# EAGLE design Base Board (EAGLE 9.5.1)
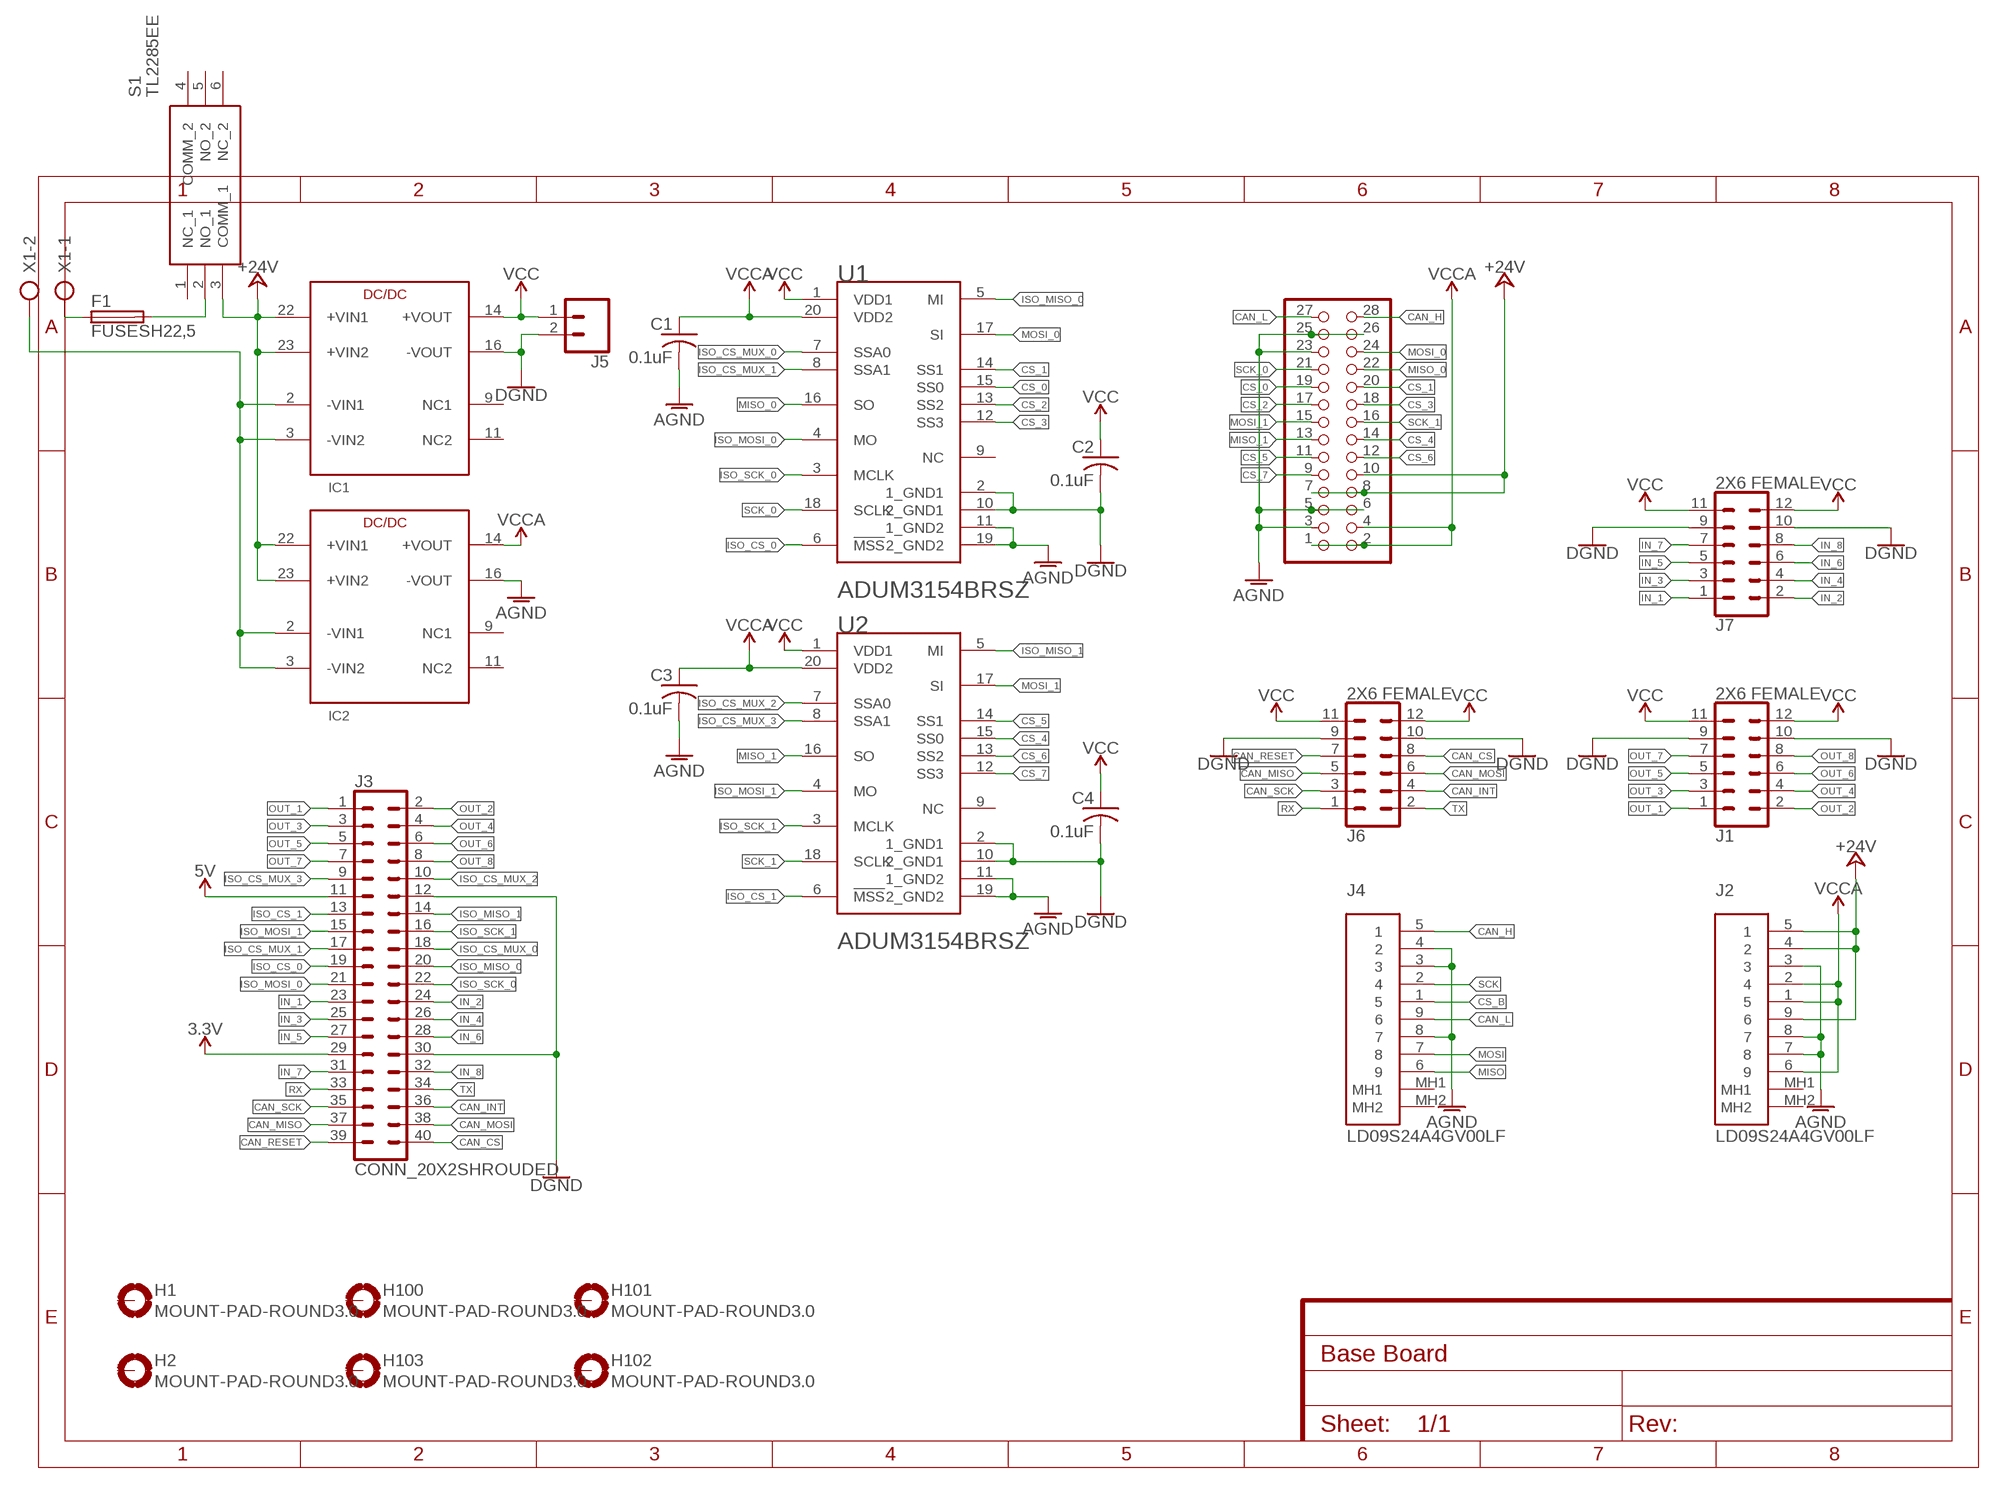
[diagram p0: schematic, sheet 1]

## Parts
C1  0.1uF  C-USC0805  [C0805]
C2  0.1uF  C-USC0805  [C0805]
C3  0.1uF  C-USC0805  [C0805]
C4  0.1uF  C-USC0805  [C0805]
F1  FUSESH22,5  [SH22,5]
H1  MOUNT-PAD-ROUND3.0  [3,0-PAD]
H2  MOUNT-PAD-ROUND3.0  [3,0-PAD]
H100  MOUNT-PAD-ROUND3.0  [3,0-PAD]
H101  MOUNT-PAD-ROUND3.0  [3,0-PAD]
H102  MOUNT-PAD-ROUND3.0  [3,0-PAD]
H103  MOUNT-PAD-ROUND3.0  [3,0-PAD]
IC1  TEL_5_SERIES  [TEL_5_SERIES]
IC2  TEL_5_SERIES  [TEL_5_SERIES]
J1  2X6 FEMALE  CONN_06X2PTH_FEMALE  [2X6]
J2  LD09S24A4GV00LF  [LD09S24A4GV00LF]
J3  CONN_20X2SHROUDED  [2X20_SHROUDED]
J4  LD09S24A4GV00LF  [LD09S24A4GV00LF]
J5  CONN_02POLAR_LOCK  [MOLEX-1X2_LOCK]
J6  2X6 FEMALE  CONN_06X2PTH_FEMALE  [2X6]
J7  2X6 FEMALE  CONN_06X2PTH_FEMALE  [2X6]
JP1  PINHD-2X14/90  [2X14/90]
S1  TL2285EE  [TL2285EE]
U1  ANALOG_DEVICES_INC_ADUM3154BRSZANALOG_DEVICES_INC_ADUM3154BRSZ_0_0  [ANALOG_DEVICES_INC_ADUM3154BRSZ_0]
U2  ANALOG_DEVICES_INC_ADUM3154BRSZANALOG_DEVICES_INC_ADUM3154BRSZ_0_0  [ANALOG_DEVICES_INC_ADUM3154BRSZ_0]
X1  AK500/2-H  [AK500/2-H]

## Nets
3.3V: J3.29
5V: J3.11
+24V: IC1.22(+VIN1) IC1.23(+VIN2) IC2.22(+VIN1) IC2.23(+VIN2) J2.4 J2.5 J2.9 JP1.7 JP1.8 JP1.10 S1.3(COMM_1)
AGND: C1.2 C3.2 IC2.16(-VOUT) J2.3 J2.7 J2.8 J4.3 J4.4 J4.8 JP1.3 JP1.5 JP1.6 JP1.23 JP1.25 JP1.26 U1.11(1_GND2) U1.19(2_GND2) U2.11(1_GND2) U2.19(2_GND2)
CAN_CS: J3.40 J6.8
CAN_H: J4.5 JP1.28
CAN_INT: J3.36 J6.4
CAN_L: J4.9 JP1.27
CAN_MISO: J3.37 J6.5
CAN_MOSI: J3.38 J6.6
CAN_RESET: J3.39 J6.7
CAN_SCK: J3.35 J6.3
CS_0: JP1.19 U1.15(SS0)
CS_1: JP1.20 U1.14(SS1)
CS_2: JP1.17 U1.13(SS2)
CS_3: JP1.18 U1.12(SS3)
CS_4: JP1.14 U2.15(SS0)
CS_5: JP1.11 U2.14(SS1)
CS_6: JP1.12 U2.13(SS2)
CS_7: JP1.9 U2.12(SS3)
CS_B: J4.1
GND: C2.2 C4.2 IC1.16(-VOUT) J1.9 J1.10 J3.12 J3.30 J5.2 J6.9 J6.10 J7.9 J7.10 U1.2(1_GND1) U1.10(2_GND1) U2.2(1_GND1) U2.10(2_GND1) ; supply symbol labelled DGND
IN_1: J3.23 J7.1
IN_2: J3.24 J7.2
IN_3: J3.25 J7.3
IN_4: J3.26 J7.4
IN_5: J3.27 J7.5
IN_6: J3.28 J7.6
IN_7: J3.31 J7.7
IN_8: J3.32 J7.8
ISO_CS_0: J3.19 U1.6(!MSS!)
ISO_CS_1: J3.13 U2.6(!MSS!)
ISO_CS_MUX_0: J3.18 U1.7(SSA0)
ISO_CS_MUX_1: J3.17 U1.8(SSA1)
ISO_CS_MUX_2: J3.10 U2.7(SSA0)
ISO_CS_MUX_3: J3.9 U2.8(SSA1)
ISO_MISO_0: J3.20 U1.5(MI)
ISO_MISO_1: J3.14 U2.5(MI)
ISO_MOSI_0: J3.21 U1.4(MO)
ISO_MOSI_1: J3.15 U2.4(MO)
ISO_SCK_0: J3.22 U1.3(MCLK)
ISO_SCK_1: J3.16 U2.3(MCLK)
MISO: J4.6
MISO_0: JP1.22 U1.16(SO)
MISO_1: JP1.13 U2.16(SO)
MOSI: J4.7
MOSI_0: JP1.24 U1.17(SI)
MOSI_1: JP1.15 U2.17(SI)
N$1: IC1.2(-VIN1) IC1.3(-VIN2) IC2.2(-VIN1) IC2.3(-VIN2) X1.2
N$2: F1.1 X1.1
N$3: F1.2 S1.2(NO_1)
OUT_1: J1.1 J3.1
OUT_2: J1.2 J3.2
OUT_3: J1.3 J3.3
OUT_4: J1.4 J3.4
OUT_5: J1.5 J3.5
OUT_6: J1.6 J3.6
OUT_7: J1.7 J3.7
OUT_8: J1.8 J3.8
RX: J3.33 J6.1
SCK: J4.2
SCK_0: JP1.21 U1.18(SCLK)
SCK_1: JP1.16 U2.18(SCLK)
TX: J3.34 J6.2
VCC: C2.1 C4.1 IC1.14(+VOUT) J1.11 J1.12 J5.1 J6.11 J6.12 J7.11 J7.12 U1.1(VDD1) U2.1(VDD1)
VCCA: C1.1 C3.1 IC2.14(+VOUT) J2.1 J2.2 J2.6 JP1.1 JP1.2 JP1.4 U1.20(VDD2) U2.20(VDD2)
Unconnected: H1.B3,0(MOUNT) H2.B3,0(MOUNT) H100.B3,0(MOUNT) H101.B3,0(MOUNT) H102.B3,0(MOUNT) H103.B3,0(MOUNT) IC1.9(NC1) IC1.11(NC2) IC2.9(NC1) IC2.11(NC2) J2.MH1 J2.MH2 J4.MH1 J4.MH2 S1.1(NC_1) S1.4(COMM_2) S1.5(NO_2) S1.6(NC_2) U1.9(NC) U2.9(NC)

## Library data of the parts
C1-C4 = adafruit:C-US: CAPACITOR, American symbol
F1 = fuse:FUSE: Fuse; OC_FARNELL: unknown; OC_NEWARK: unknown
H1 H2 H100-H103 = holes:MOUNT-PAD-ROUND: MOUNTING PAD, round
IC1 IC2 = traco_thl_tel_series:TEL_5_SERIES: TRACO POWER DC/DC converter TEL 5 Series created by Mario Blunk - electronics & IT engineering at www.train-z.de
J1 J6 J7 = SparkFun-Connectors:CONN_06X2: Multi connection point. Often used as Generic Header-pin footprint for 0.1 inch spaced/style header connections On any of the 0.1 inch spaced packages, you can populate with these: Break Away Headers - Straight <https://www.sparkfun.com/products/116> (PRT-00116) Break Away Male Headers - Right Angle <https://www.sparkfun.com/products/553> (PRT-00553) Female Headers <https://www.sparkfun.com/products/115> (PRT-00115) Break Away Headers - Machine Pin <https://www.sparkfun.com/products/117> (PRT-00117) Break Away Female Headers - Swiss Machine Pin <https://www.sparkfun.com/products/743> (PRT-00743); PROD_ID: CONN-12423
J2 J4 = D-Sub Connectors:LD09S24A4GV00LF: CONN D-SUB RCPT 9POS VERT SOLDER Manufacturer's datasheet <https://www.amphenol-icc.com/media/wysiwyg/files/drawing/10130912.pdf>; CREATED_BY: PCBLayout.com; DIGIKEY_PART_NUMBER: 609-5190-ND; MANUFACTURER: Amphenol ICC (FCI); MPN: LD09S24A4GV00LF
J3 = SparkFun-Connectors:CONN_20X2: Multi connection point. Often used as Generic Header-pin footprint for 0.1 inch spaced/style header connections On any of the 0.1 inch spaced packages, you can populate with these: Break Away Headers - Straight <https://www.sparkfun.com/products/116> (PRT-00116) Break Away Male Headers - Right Angle <https://www.sparkfun.com/products/553> (PRT-00553) Female Headers <https://www.sparkfun.com/products/115> (PRT-00115) Break Away Headers - Machine Pin <https://www.sparkfun.com/products/117> (PRT-00117) Break Away Female Headers - Swiss Machine Pin <https://www.sparkfun.com/products/743> (PRT-00743); PROD_ID: CONN-12263; SF_ID: CONN-12263
J5 = SparkFun-Connectors:CONN_02: Multi connection point. Often used as Generic Header-pin footprint for 0.1 inch spaced/style header connections On any of the 0.1 inch spaced packages, you can populate with these: Break Away Headers - Straight <https://www.sparkfun.com/products/116> (PRT-00116) Break Away Male Headers - Right Angle <https://www.sparkfun.com/products/553> (PRT-00553) Female Headers <https://www.sparkfun.com/products/115> (PRT-00115) Break Away Headers - Machine Pin <https://www.sparkfun.com/products/117> (PRT-00117) Break Away Female Headers - Swiss Machine Pin <https://www.sparkfun.com/products/743> (PRT-00743) For SCREWTERMINALS and SPRING TERMINALS visit here: Screw Terimnals on SparkFun.com <https://www.sparkfun.com/search/results?term=Screw+Terminals> (5mm/3.5mm/2.54mm spacing) This device is also useful as a general connection point to wire up your design to another part of your project. Our various solder wires solder well into these plated through hole pads. Hook-Up Wire - Assortment (Stranded, 22 AWG) <https://www.sparkfun.com/products/11375> (PRT-11375) Hook-Up Wire - Assortment (Solid Core, 22 AWG) <https://www.sparkfun.com/products/11367> (PRT-11367) View the entire wire category on our website here <https://www.sparkfun.com/categories/141> Special notes: Molex polarized connector foot print use with: PRT-08233 with associated crimp pins and housings. 2.54_SCREWTERM for use with PRT-10571. 3.5mm Screw Terminal footprints for PRT-08084 5mm Screw Terminal footprints for use with PRT-08432; SF_ID: PRT-09918
JP1 = pinhead:PINHD-2X14: PIN HEADER
S1 = TL2285EE:TL2285EE: Tactile Switches DPDT ALT ACT PC MNT Source: Datasheet <https://componentsearchengine.com/Datasheets/1/TL2285EE.pdf>; DESCRIPTION: Tactile Switches DPDT ALT ACT PC MNT; HEIGHT: 13mm; MANUFACTURER_NAME: E-Switch; MANUFACTURER_PART_NUMBER: TL2285EE; MOUSER_PART_NUMBER: 612-TL2285EE
U1 U2 = Analog Devices Inc - ADUM3154BRSZ:ANALOG_DEVICES_INC_ADUM3154BRSZ: Digital Isolators 20-Pin SSOP Tube; AMBIENT_TEMPERATURE_RANGE_HIGH: +125°C; AMBIENT_TEMPERATURE_RANGE_LOW: -40°C; CENTROID_NOT_SPECIFIED: No; DATASHEET: http://www.analog.com/media/en/technical-documentation/data-sheets/ADuM3154.pdf; DEVICE_CLASS_L1: Integrated Circuits (ICs); DEVICE_CLASS_L2: Interface ICs; DEVICE_CLASS_L3: unset; DIGIKEY_DESCRIPTION: IC DGTL ISO 3.75KV 4CH SPI 20SSOP; DIGIKEY_PART_NUMBER: ADUM3154BRSZ-ND; FOOTPRINT_PARAMETERS_0: {"fp_type":"SSOP","params":{"N":{"nom":20,"long name":"Number of leads","min":null,"max":null,"short name":"N","type":"count"},"A":{"nom":false,"long name":"Height","min":false,"max":2000000,"short name":"A","type":"measurement"},"A1":{"nom":false,"long name":"Package clearance","min":50000,"max":false,"short name":"A1","type":"measurement"},"A2":{"nom":1750000,"long name":"Package height","min":1650000,"max":1850000,"short name":"A2","type":"measurement"},"E":{"nom":7800000,"long name":"Width /w leads","min":7400000,"max":8199999,"short name":"E","type":"measurement"},"E1":{"nom":5300000,"long name":"Package width","min":5000000,"max":5600000,"short name":"E1","type":"measurement"},"D":{"nom":7200000,"long name":"Package length","min":6900000,"max":7500000,"short name":"D","type":"measurement"},"B":{"nom":false,"long name":"Lead width","min":220000,"max":380000,"short name":"B","type":"measurement"},"C":{"nom":false,"long name":"Lead thickness","min":90000,"max":250000,"short name":"C","type":"measurement"},"L":{"nom":750000,"long name":"Lead foot length","min":550000,"max":950000,"short name":"L","type":"measurement"},"e":{"nom":650000,"long name":"Lead pitch","min":null,"max":null,"short name":"e","type":"measurement"},"PHI":{"nom":false,"long name":"Lead angle","min":0,"max":8,"short name":"PHI","type":"measurement"},"HT":{"default":"No","long name":"Thermal pad","type":"multichoiceparent","short name":"HT","children":[]},"offset x":{"nom":0,"long name":"X Center offset","min":null,"max":null,"short name":"offset x","type":"measurement"},"offset y":{"nom":0,"long name":"Y Center offset","min":null,"max":null,"short name":"offset y","type":"measurement"},"LS":{"default":"Rounded rectangle","long name":"Land shape","type":"multichoice","short name":"LS"},"LS1":{"default":"Rectangle","long name":"Land shape (Pin 1)","type":"multichoice","short name":"LS1"},"solder toe":{"nom":150000,"long name":"Solder fillet (toe)","min":null,"max":null,"short name":"solder toe","type":"fixedmeasurement"},"solder heel":{"nom":250000,"long name":"Solder fillet (heel)","min":null,"max":null,"short name":"solder heel","type":"fixedmeasurement"},"solder side":{"nom":10000,"long name":"Solder fillet (side)","min":null,"max":null,"short name":"solder side","type":"fixedmeasurement"},"courtyard":{"nom":100000,"long name":"Courtyard","min":null,"max":null,"short name":"courtyard","type":"fixedmeasurement"},"SF":{"default":"C","long name":"Packing level","type":"multichoiceparent","short name":"SF","help":"http://support.upverter.com/customer/portal/articles/978783-what-is-a-footprint-packing-level","children":["solder toe","solder heel","solder side","courtyard"]}}}; HEIGHT: 2mm; INTERFACE: SPI; IPC_LAND_PATTERN_NAME: SOP65P780X200-20; LEAD_FREE: yes; MAX_SUPPLY_VOLTAGE: 5.5V; MF: Analog Devices Inc; MFG_PACKAGE_IDENT: RS-20; MFG_PACKAGE_IDENT_DATE: 0; MFG_PACKAGE_IDENT_REV: A; MIN_SUPPLY_VOLTAGE: 3V; MOUSER_DESCRIPTION: Digital Isolators Multip Slave Isolatr for SPI Intrface; MOUSER_PART_NUMBER: 584-ADUM3154BRSZ; MPN: ADUM3154BRSZ; PACKAGE: SSOP20; PIN_0_0_13_INSIDE_EDGE: clock; PIN_0_0_9_INSIDE_EDGE: clock; PREFIX: U; ROHS: yes; STANDOFF_HEIGHT: 0.05mm; TEMPERATURE_RANGE_HIGH: +125°C; TEMPERATURE_RANGE_LOW: -40°C; VERIFICATION_VERSION: 0.0.0.1
X1 = con-ptr500:AK500/2-H: CONNECTOR Aug. 2004 / PTR Meßtechnik: Die Bezeichnung der Serie AK505 wurde geändert. Es handelt sich hierbei um AK500 in horizontaler Ausführung.; OC_FARNELL: unknown; OC_NEWARK: unknown

## Net classes
0 default: width 0.305 mm
1 Power: width 2.032 mm

## Board
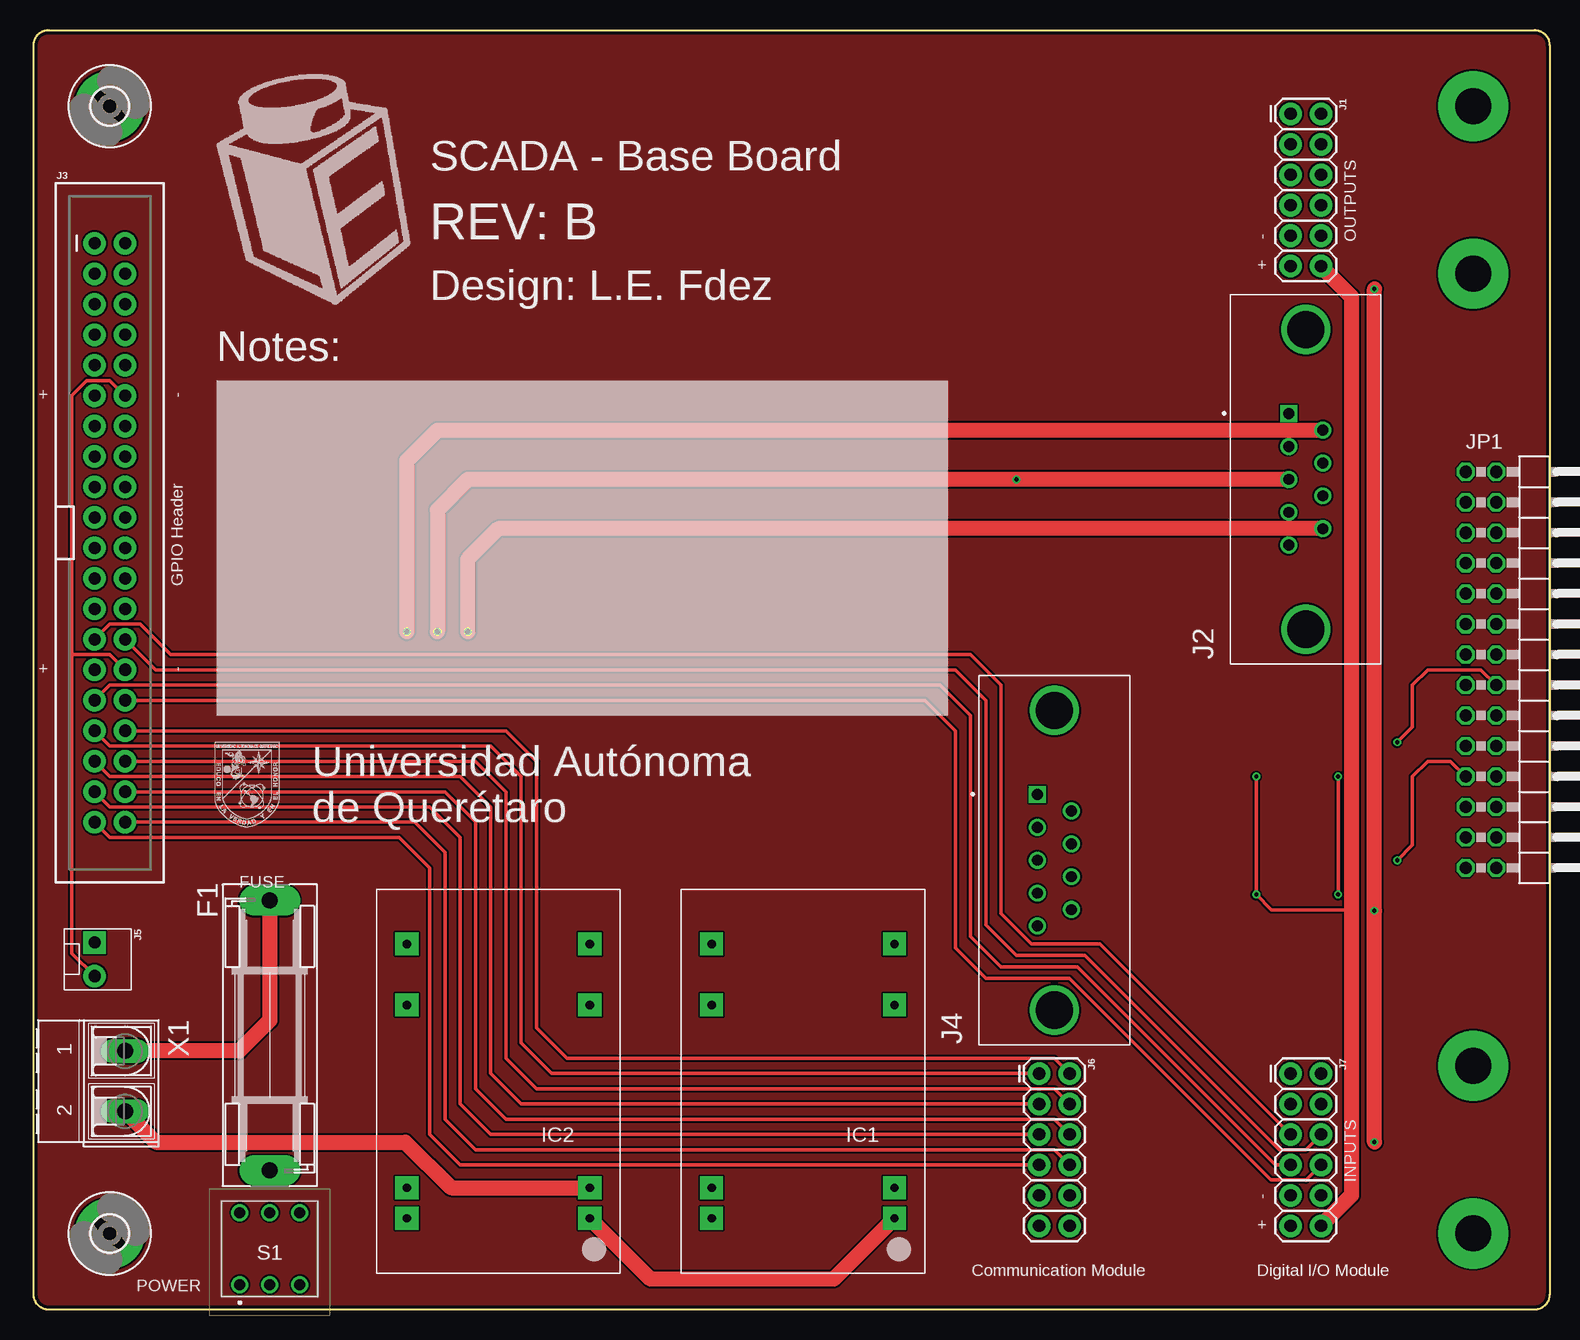
[diagram p1: board, top side]
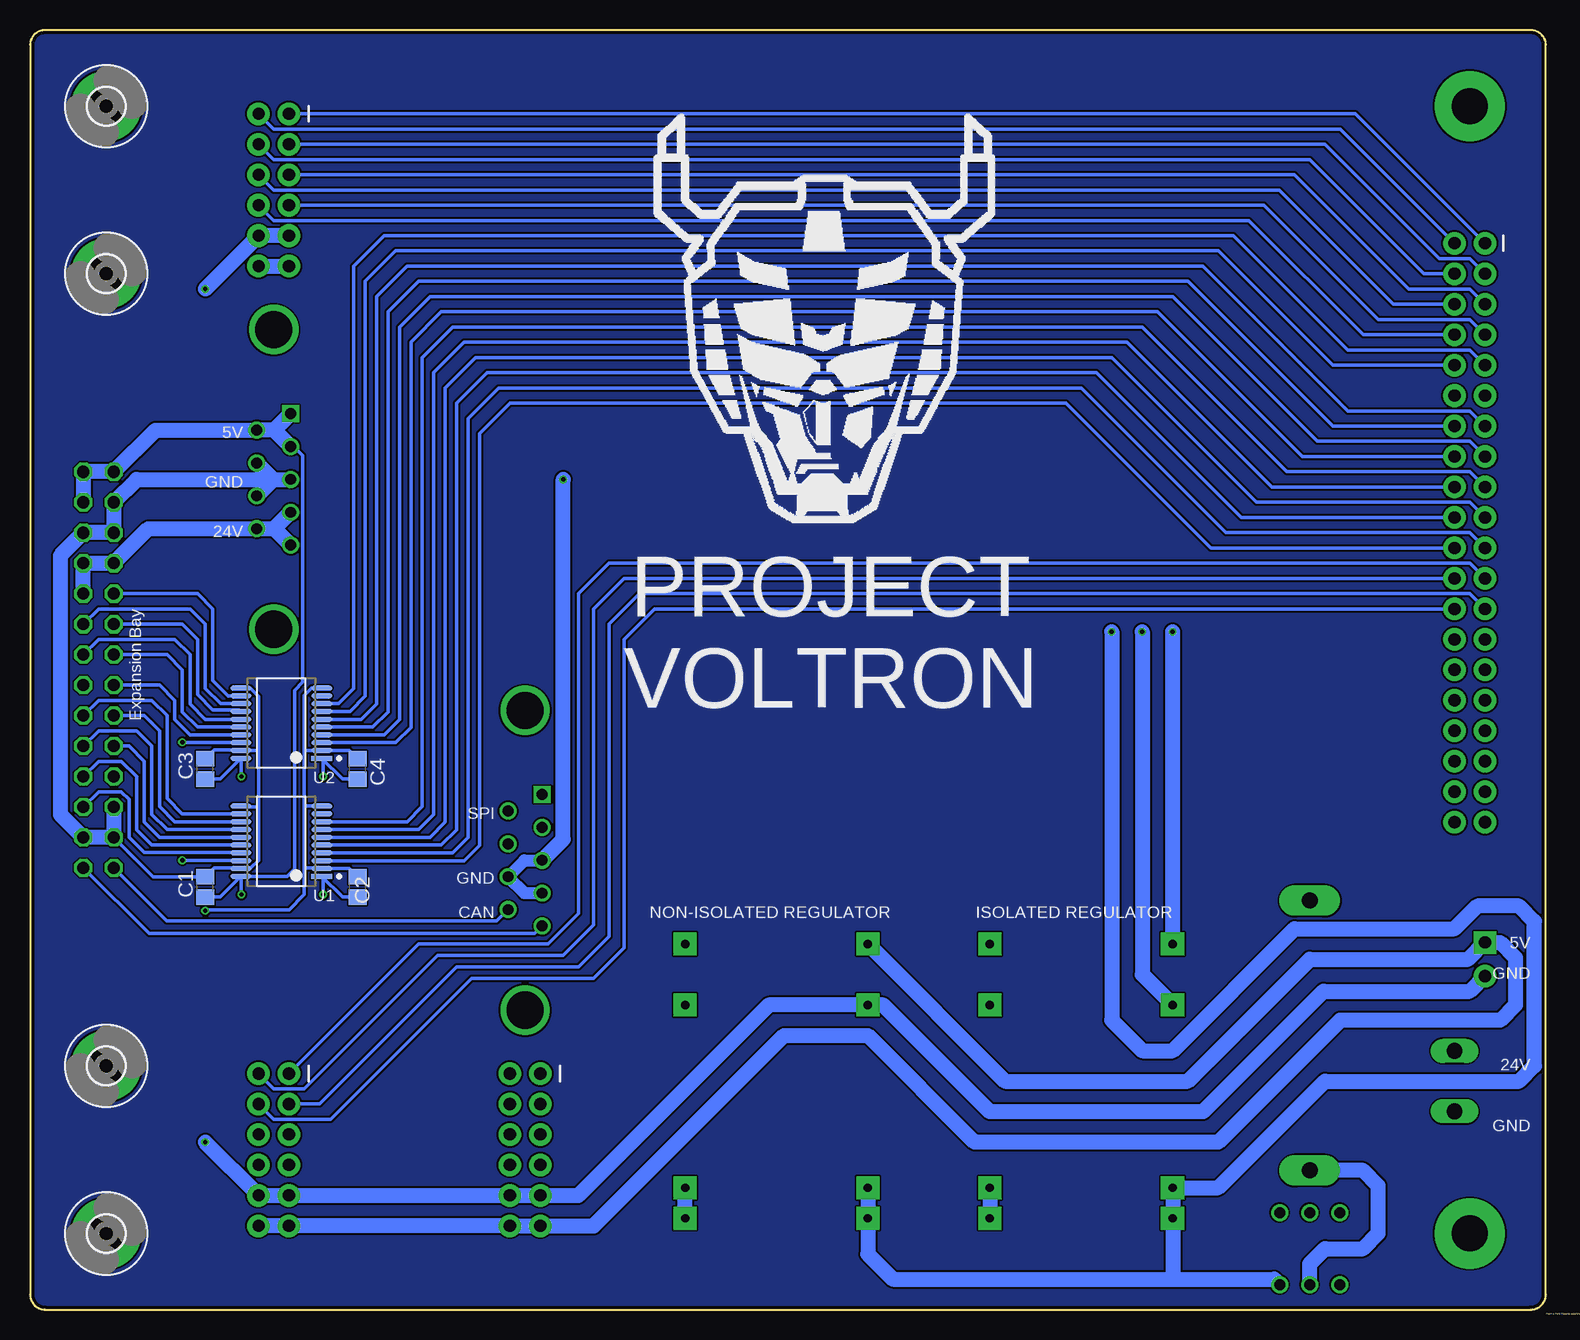
[diagram p2: board, bottom side, seen from below]

Size 126.36 x 106.68 mm. Coordinates in mm from the lower left corner, seen from the top.
Outline: 0,1.27 0,105.41 arc-90 1.27,106.68 125.09,106.68 arc-90 126.36,105.41 126.36,1.27 arc-90 125.09,0 1.27,0 arc-90 0,1.27
Copper layers (1*16): Top 0.035mm / dielectric 1.5mm / Bottom 0.035mm
Design rules "SeeedStudio_2layer_DRU_no_angle_20140221": minimum track width 6mil, minimum drill 12mil, track to track 6mil, track to pad 6mil, pad to pad 6mil, via to via 6mil, smd to smd 0mil, copper to edge 10mil, drill to drill 10mil, minimum pad ring 10mil, minimum via ring 6mil, stop-mask expansion 2mil, vias tented up to drill 100mil, thermal gap 10mil

### Footprints (pad centres in the part's own frame; a part is rotated, then mirrored left to right if it is on the bottom)
C0805 = smd 1.3 x 1.5: 1 -0.85,0; 2 0.85,0
SH22,5 = drill 1.321 pad 2.54 long: 1 -11.252,0; 2 11.252,0
3,0-PAD = drill 3 pad 5.842: B3,0 0,0
TEL_5_SERIES = drill 0.7 pad 1.93 square: 2 -11.43,-7.62; 3 -8.89,-7.62; 9 6.35,-7.62; 11 11.43,-7.62; 14 11.43,7.62; 16 6.35,7.62; 22 -8.89,7.62; 23 -11.43,7.62
2X6 = drill 1.016 pad 1.88: 1 0,0; 2 0,2.54; 3 2.54,0; 4 2.54,2.54; 5 5.08,0; 6 5.08,2.54; 7 7.62,0; 8 7.62,2.54; 9 10.16,0; 10 10.16,2.54; 11 12.7,0; 12 12.7,2.54
LD09S24A4GV00LF = drill 0.9 square: 1 5.48,1.42 | drill 0.9: 2 2.74,1.42; 3 0,1.42; 4 -2.74,1.42; 5 -5.48,1.42; 6 4.11,-1.42; 7 1.37,-1.42; 8 -1.37,-1.42; 9 -4.11,-1.42 | drill 3.1: MH1 -12.495,0; MH2 12.495,0
2X20_SHROUDED = drill 1.016 pad 1.88: 1 -1.27,24.13; 2 1.27,24.13; 3 -1.27,21.59; 4 1.27,21.59; 5 -1.27,19.05; 6 1.27,19.05; 7 -1.27,16.51; 8 1.27,16.51; 9 -1.27,13.97; 10 1.27,13.97; 11 -1.27,11.43; 12 1.27,11.43; 13 -1.27,8.89; 14 1.27,8.89; 15 -1.27,6.35; 16 1.27,6.35; 17 -1.27,3.81; 18 1.27,3.81; 19 -1.27,1.27; 20 1.27,1.27; 21 -1.27,-1.27; 22 1.27,-1.27; 23 -1.27,-3.81; 24 1.27,-3.81; 25 -1.27,-6.35; 26 1.27,-6.35; 27 -1.27,-8.89; 28 1.27,-8.89; 29 -1.27,-11.43; 30 1.27,-11.43; 31 -1.27,-13.97; 32 1.27,-13.97; 33 -1.27,-16.51; 34 1.27,-16.51; 35 -1.27,-19.05; 36 1.27,-19.05; 37 -1.27,-21.59; 38 1.27,-21.59; 39 -1.27,-24.13; 40 1.27,-24.13
MOLEX-1X2_LOCK = drill 1.016 pad 1.88 square: 1 -0.127,0 | drill 1.016 pad 1.88: 2 2.667,0
2X14/90 = drill 1.016 octagon: 1 -16.51,-6.35; 2 -16.51,-3.81; 3 -13.97,-6.35; 4 -13.97,-3.81; 5 -11.43,-6.35; 6 -11.43,-3.81; 7 -8.89,-6.35; 8 -8.89,-3.81; 9 -6.35,-6.35; 10 -6.35,-3.81; 11 -3.81,-6.35; 12 -3.81,-3.81; 13 -1.27,-6.35; 14 -1.27,-3.81; 15 1.27,-6.35; 16 1.27,-3.81; 17 3.81,-6.35; 18 3.81,-3.81; 19 6.35,-6.35; 20 6.35,-3.81; 21 8.89,-6.35; 22 8.89,-3.81; 23 11.43,-6.35; 24 11.43,-3.81; 25 13.97,-6.35; 26 13.97,-3.81; 27 16.51,-6.35; 28 16.51,-3.81
TL2285EE = drill 0.9 pad 1.4: 1 -2.5,-3; 2 0,-3; 3 2.5,-3; 4 -2.5,3; 5 0,3; 6 2.5,3
ANALOG_DEVICES_INC_ADUM3154BRSZ_0 = smd 1.753 x 0.415: 1 -3.375,2.925; 2 -3.375,2.275; 3 -3.375,1.625; 4 -3.375,0.975; 5 -3.375,0.325; 6 -3.375,-0.325; 7 -3.375,-0.975; 8 -3.375,-1.625; 9 -3.375,-2.275; 10 -3.375,-2.925; 11 3.375,-2.925; 12 3.375,-2.275; 13 3.375,-1.625; 14 3.375,-0.975; 15 3.375,-0.325; 16 3.375,0.325; 17 3.375,0.975; 18 3.375,1.625; 19 3.375,2.275; 20 3.375,2.925
AK500/2-H = drill 1.321 long: 1 -2.515,0; 2 2.515,0

### Placement (x,y rotation side)
C1  111.76,35.24 90 bottom
C2  99.06,35.24 90 bottom
C3  111.76,45.09 90 bottom
C4  99.06,45.09 90 bottom
F1  19.68,22.86 270 top
H1  6.35,100.33 0 top
H2  6.35,6.35 0 top
H100  120.02,6.35 0 bottom
H101  120.02,20.32 0 bottom
H102  120.02,86.36 0 bottom
H103  120.02,100.33 0 bottom
IC1  64.14,19.05 90 top
IC2  38.73,19.05 90 top
J1  104.78,99.69 270 top
J2  106.05,69.22 90 top
J3  6.35,64.77 0 top
J4  85.09,37.47 90 top
J5  5.08,30.48 270 top
J6  83.82,19.68 270 top
J7  104.78,19.68 270 top
JP1  125.73,53.34 270 top
S1  19.68,5.08 0 top
U1  105.41,39.05 180 bottom
U2  105.41,48.9 180 bottom
X1  7.62,19.05 270 top

### Tracks (layer width: path | path; a pad name or v marks a point on that pad's centre or on a via)
+24V  (via drill 0.35)
  Top 1.27: J2.9 38.73,65.11 36.2,62.56 v36.2,56.52
  Bottom 1.27: 106,65.11 J2.4 | 106,65.11 J2.9 116.5,65.11 JP1.7 JP1.8 JP1.10 | 106,65.11 J2.5 | S1.3 22.64,2.54 31.11,2.54 | 31.11,2.54 54.44,2.54 56.52,4.62 IC1.23 IC1.22 | 31.11,2.54 IC2.23 IC2.22 27.3,10.16 18.41,19.05 2.23,19.05 0.96,20.32 0.96,32.38 2.23,33.66 5.71,33.66 7.62,31.75 20.95,31.75 31.11,21.59 33.66,21.59 36.2,24.13 v36.2,56.52
AGND  (via drill 0.35)
  Top 1.27: J2.3 v81.92,69.22 36.2,69.22 33.66,66.67 v33.66,56.52
  Bottom 0.305: 108.84,36.83 U1.19 | 108.84,36.83 111.02,36.83 C1.2 116.1,36.09 JP1.25 | C3.2 111.02,46.67 108.73,46.67 U2.19 107.37,46.62 107.31,46.67 | U2.11 108.02,51.82 107.31,51.12 107.31,46.67 | 107.31,41.91 107.31,37.47 107.95,36.83 108.84,36.83 | 107.31,46.67 107.31,41.91 | U1.11 108.72,41.91 107.31,41.91
  Bottom 1.016: J4.3 85.14,37.47 J4.8 85.14,34.73 J4.4
  Bottom 1.27: J2.7 106.09,69.22 | J2.8 106.09,69.22 | 106.09,69.22 J2.3 | 106.09,69.22 117.47,69.22 JP1.3 JP1.5 JP1.6 123.83,62.87 123.83,41.27 JP1.26 JP1.25 JP1.23 | v33.66,56.52 33.66,27.94 IC2.16 | J4.3 81.92,39.22 v81.92,69.22
CAN_CS
  Top 0.305: J6.8 85.09,13.34 36.83,13.34 34.29,15.88 34.29,38.1 31.75,40.64 J3.40
CAN_H
  Bottom 0.305: JP1.28 116.44,31.35 84.31,31.35 J4.5
CAN_INT
  Top 0.305: J6.4 85.09,18.41 41.91,18.41 39.37,20.95 39.37,24.55 39.37,24.77 39.37,43.18 36.83,45.72 J3.36
CAN_L
  Bottom 0.305: J4.9 87.46,32.4 114.95,32.4 JP1.27
CAN_MISO
  Top 0.305: J3.37 6.35,41.91 33.02,41.91 35.56,39.37 35.56,17.14 38.1,14.61 J6.5
CAN_MOSI
  Top 0.305: J6.6 85.09,15.88 39.37,15.88 36.83,18.41 36.83,40.64 34.29,43.18 J3.38
CAN_RESET
  Top 0.305: J6.7 35.56,12.06 33.02,14.61 33.02,36.83 30.48,39.37 6.35,39.37 J3.39
CAN_SCK
  Top 0.305: J3.35 6.35,44.45 35.56,44.45 38.1,41.91 38.1,19.68 40.64,17.14 J6.3
COPPER
  pour Bottom: 0,105.41 0,1.27 arc90 1.27,0 125.09,0 arc90 126.36,1.27 126.36,105.41 arc90 125.09,106.68 1.27,106.68 arc90
  pour Top: 1.27,0 125.09,0 arc90 126.36,1.27 126.36,105.41 arc90 125.09,106.68 1.27,106.68 arc90 0,105.41 0,1.27 arc90
CS_0
  Bottom 0.305: U1.15 108.79,39.37 115.57,39.37 116.84,40.64 116.84,45.72 118.11,46.99 JP1.19
CS_1
  Bottom 0.305: JP1.20 120.65,48.26 117.47,48.26 116.2,46.99 116.2,41.3 114.94,40.03 U1.14
CS_2
  Bottom 0.305: JP1.17 116.84,49.53 115.57,48.26 115.57,41.95 114.3,40.68 U1.13
CS_3
  Bottom 0.305: JP1.18 120.65,50.8 116.2,50.8 114.94,49.53 114.94,42.6 113.67,41.33 U1.12
CS_4
  Bottom 0.305: JP1.14 120.65,55.88 114.3,55.88 113.03,54.61 113.03,50.49 111.76,49.22 U2.15
CS_5
  Bottom 0.305: U2.14 108.92,50.01 111.12,50.01 112.39,51.28 112.39,55.88 113.67,57.15 JP1.11
CS_6
  Bottom 0.305: JP1.12 120.65,58.42 113.03,58.42 111.76,57.15 111.76,51.79 110.49,50.52 U2.13
CS_7
  Bottom 0.305: U2.12 109.86,51.17 111.12,52.44 111.12,58.42 112.39,59.69 JP1.9
GND  (via drill 0.35)
  Top 0.305: J3.30 6.35,54.61 3.17,54.61 | 3.17,54.61 3.17,76.2 4.45,77.47 6.35,77.47 J3.12 | 3.17,54.61 3.17,29.72 J5.2
  Top 1.27: v111.76,13.97 v111.76,33.26 v111.76,85.09
  Bottom 0.305: C4.2 99.75,46.62 U2.2 103.45,46.62 103.5,46.67 | C2.2 99.75,36.78 U1.2 102.09,36.83 103.5,36.83 | 103.5,41.91 103.5,36.83 | 103.5,36.83 103.5,34.61 104.78,33.34 111.69,33.34 v111.76,33.26 | 103.5,41.91 103.5,46.67 | U2.10 102.87,51.82 103.5,51.19 103.5,46.67 | U1.10 103.44,41.98 103.5,41.91
  Bottom 1.27: J1.9 J1.10 v111.76,85.09 | J5.2 6.35,26.54 18.54,26.54 28.57,16.51 46.35,16.51 55.24,25.4 IC1.16 64.77,25.4 80.64,9.53 J6.9 J6.10 J7.9 J7.10 v111.76,13.97
IN_1
  Bottom 0.305: J3.23 6.35,62.23 78.11,62.23 80.64,59.69 80.64,33.02 83.19,30.48 93.98,30.48 J7.1
IN_2
  Bottom 0.305: J7.2 106.05,18.41 103.5,18.41 92.39,29.53 81.92,29.53 79.38,32.07 79.38,58.42 76.83,60.96 J3.24
IN_3
  Bottom 0.305: J3.25 6.35,59.69 75.56,59.69 78.11,57.15 78.11,31.11 80.64,28.57 90.81,28.57 102.23,17.14 J7.3
IN_4
  Bottom 0.305: J7.4 106.05,15.88 101.28,15.88 89.53,27.62 79.38,27.62 76.83,30.16 76.83,55.88 74.3,58.42 J3.26
IN_5
  Top 0.305: J3.27 6.35,57.15 8.89,57.15 11.43,54.61 78.11,54.61 80.64,52.07 80.64,33.02 83.19,30.48 88.9,30.48 J7.5
IN_6
  Top 0.305: J7.6 106.05,13.34 103.82,13.34 87.63,29.53 81.92,29.53 79.38,32.07 79.38,50.8 76.83,53.34 10.16,53.34 J3.28
IN_7
  Top 0.305: J3.31 6.35,52.07 75.56,52.07 78.11,49.53 78.11,31.11 80.64,28.57 87,28.57 103.5,12.06 J7.7
IN_8
  Top 0.305: J7.8 106.05,10.79 106.02,10.82 103.15,10.82 86.35,27.62 79.38,27.62 76.83,30.16 76.83,48.26 74.3,50.8 J3.32
ISO_CS_0
  Bottom 0.305: J3.19 6.35,67.31 24.13,67.31 36.2,79.38 89.22,79.38 91.76,76.83 91.76,40.65 93.03,39.38 U1.6
ISO_CS_1
  Bottom 0.305: U2.6 98.74,49.22 97.47,50.49 97.47,84.45 94.93,87 28.57,87 16.51,74.93 6.35,74.93 J3.13
ISO_CS_MUX_0
  Bottom 0.305: U1.7 93.98,40.03 92.71,41.3 92.71,78.11 90.17,80.64 34.92,80.64 22.86,68.58 J3.18
ISO_CS_MUX_1
  Bottom 0.305: J3.17 6.35,69.85 21.59,69.85 33.66,81.92 91.12,81.92 93.66,79.38 93.66,41.95 94.93,40.68 U1.8
ISO_CS_MUX_2
  Bottom 0.305: J3.10 17.78,78.74 27.3,88.27 95.89,88.27 98.42,85.72 98.42,51.14 99.69,49.87 U2.7
ISO_CS_MUX_3
  Bottom 0.305: J3.9 6.35,80.01 16.51,80.01 26.04,89.53 96.84,89.53 99.38,87 99.38,51.79 100.65,50.52 U2.8
ISO_MISO_0
  Bottom 0.305: U1.5 92.08,38.73 90.81,40 90.81,75.56 88.27,78.11 37.47,78.11 25.4,66.04 J3.20
ISO_MISO_1
  Bottom 0.305: J3.14 17.78,73.66 29.84,85.72 93.98,85.72 96.52,83.19 96.52,49.84 97.79,48.57 U2.5
ISO_MOSI_0
  Bottom 0.305: U1.4 91.12,38.08 89.85,39.35 89.85,74.3 87.31,76.83 38.73,76.83 26.67,64.77 6.35,64.77 J3.21
ISO_MOSI_1
  Bottom 0.305: U2.4 96.84,47.92 95.57,49.19 95.57,81.92 93.03,84.45 31.11,84.45 19.05,72.39 6.35,72.39 J3.15
ISO_SCK_0
  Bottom 0.305: J3.22 27.94,63.5 40.01,75.56 86.36,75.56 88.9,73.03 88.9,38.7 90.17,37.43 U1.3
ISO_SCK_1
  Bottom 0.305: J3.16 20.32,71.12 32.38,83.19 92.08,83.19 94.61,80.64 94.61,48.54 95.89,47.27 U2.3
MISO_0
  Bottom 0.305: U1.16 116.2,38.73 117.47,40 117.47,44.45 118.75,45.72 120.65,45.72 JP1.22
MISO_1
  Bottom 0.305: U2.16 112.39,48.57 113.67,49.84 113.67,53.34 114.94,54.61 JP1.13
MOSI_0
  Bottom 0.305: JP1.24 120.65,43.18 118.75,43.18 118.11,42.55 118.11,39.37 116.84,38.1 108.81,38.1 U1.17
MOSI_1
  Bottom 0.305: U2.17 113.03,47.92 114.3,49.19 114.3,50.8 115.57,52.07 JP1.15
N$1
  Top 1.27: IC2.3 34.79,10.16 30.98,13.97 10.19,13.97 X1.2 | IC1.2 66.67,2.54 51.44,2.54 IC2.2
  Bottom 1.27: IC2.3 IC2.2 | IC1.2 IC1.3
N$2
  Top 1.27: F1.1 19.68,24.11 17.14,21.57 X1.1
N$3
  Bottom 1.27: S1.2 19.68,3.81 18.41,5.08 15.24,5.08 13.97,6.35 13.97,10.34 15.24,11.61 F1.2
OUT_1
  Bottom 0.305: J3.1 15.88,99.69 J1.1
OUT_2
  Bottom 0.305: J3.2 17.14,98.42 106.05,98.42 J1.2
OUT_3
  Bottom 0.305: J3.3 6.35,87.63 8.89,87.63 18.41,97.16 J1.3
OUT_4
  Bottom 0.305: J1.4 106.05,95.89 19.68,95.89 10.16,86.36 J3.4
OUT_5
  Bottom 0.305: J3.5 6.35,85.09 11.43,85.09 20.95,94.61 J1.5
OUT_6
  Bottom 0.305: J1.6 106.05,93.34 22.23,93.34 12.7,83.82 J3.6
OUT_7
  Bottom 0.305: J3.7 6.35,82.55 13.97,82.55 23.5,92.08 J1.7
OUT_8
  Bottom 0.305: J1.8 106.05,90.81 24.77,90.81 15.24,81.28 J3.8
RX
  Top 0.305: J3.33 6.35,46.99 38.1,46.99 40.64,44.45 40.64,22.23 43.18,19.68 J6.1
SCK_0  (via drill 0.35)
  Top 0.305: JP1.21 118.11,45.72 116.2,45.72 114.94,44.45 114.94,38.73 v113.67,37.47
  Bottom 0.305: v113.67,37.47 108.82,37.47 U1.18
SCK_1  (via drill 0.35)
  Top 0.305: JP1.16 120.65,53.34 116.2,53.34 114.94,52.07 114.94,48.58 v113.67,47.31
  Bottom 0.305: U2.18 113.63,47.27 v113.67,47.31
TX
  Top 0.305: J6.2 85.09,20.95 44.45,20.95 41.91,23.5 41.91,45.72 39.37,48.26 J3.34
VCC  (via drill 0.35)
  Top 0.305: v101.92,44.45 v101.92,34.61 103.19,33.34 109.86,33.34
  Top 1.27: J1.12 109.86,84.45 109.86,33.34 109.86,9.53 J7.12
  Bottom 0.305: C4.1 100.3,44.23 U2.1 101.92,45.85 v101.92,44.45 | C2.1 100.3,34.39 U1.1 101.92,36.01 v101.92,34.61
  Bottom 1.27: J7.12 J7.11 J6.12 J6.11 79.38,6.99 63.5,22.86 56.52,22.86 47.62,13.97 27.3,13.97 17.14,24.13 3.81,24.13 2.54,25.4 2.54,29.34 3.81,30.61 J5.1 6.48,29.21 19.68,29.21 29.84,19.05 45.09,19.05 IC1.14 | J1.12 J1.11
VCCA  (via drill 0.35)
  Top 0.305: v108.74,34.61 v108.74,44.45
  Top 1.27: v31.11,56.52 31.11,70.78 33.66,73.33 J2.6
  Bottom 0.305: U1.20 110.52,34.39 C1.1 | C3.1 110.52,44.23 U2.20 108.74,45.92 v108.74,44.45 | U1.20 108.74,36.08 v108.74,34.61 | U1.20 104.94,36.13 104.31,36.76 104.31,51.62 103.62,52.31 103.62,71.22 104.35,71.95 J2.2
  Bottom 1.27: 106,73.33 J2.1 | J2.2 106,73.33 | 106,73.33 J2.6 115.91,73.33 JP1.1 JP1.2 JP1.4 | IC2.14 v31.11,56.52

### Text on the board
tPlace: OUTPUTS | SCADA - Base Board | REV: B | Design: L.E. Fdez | Notes: | Universidad Autónoma / de Querétaro | FUSE | INPUTS | Communication Module | Digital I/O Module | POWER
bPlace: 5V | GND | 24V | Expansion Bay | PROJECT / VOLTRON | SPI | GND | ISOLATED REGULATOR | NON-ISOLATED REGULATOR | CAN | 5V | GND | 24V | GND | /home/lefr/Downloads/black.bmp
tNames: - | + | - | + | GPIO Header | - | + | - | +